# EAGLE design audio_jack_passthru (EAGLE 9.6.2)
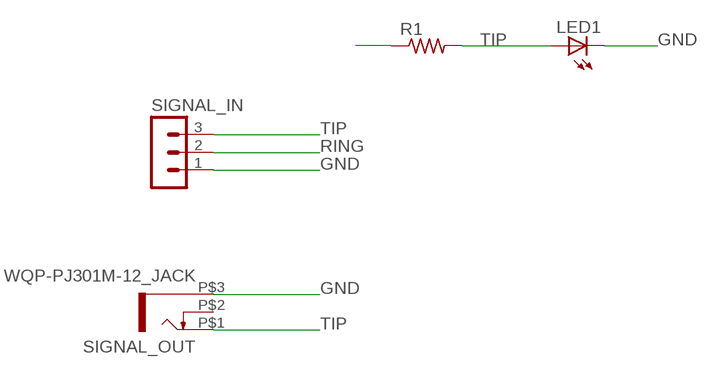
[diagram p0: schematic, sheet 1]

## Parts
LED1  LED3MM  [LED3MM]
R1  R-US_R0805  [R0805]
SIGNAL_IN  MA03-1  [MA03-1]
SIGNAL_OUT  WQP-PJ301M-12_JACK  [WQP-PJ301M-12_JACK]

## Nets
GND: LED1.K(C) SIGNAL_IN.1 SIGNAL_OUT.P$3
RING: SIGNAL_IN.2
TIP: LED1.A R1.1 R1.2 SIGNAL_IN.3 SIGNAL_OUT.P$1
Unconnected: SIGNAL_OUT.P$2

## Library data of the parts
LED1 = adafruit:LED: LED OSRAM: - CHIPLED LG R971, LG N971, LY N971, LG Q971, LY Q971, LO R971, LY R971 LH N974, LH R974 LS Q976, LO Q976, LY Q976 LO Q996 - Hyper CHIPLED LW Q18S LB Q993, LB Q99A, LB R99A - SideLED LS A670, LO A670, LY A670, LG A670, LP A670 LB A673, LV A673, LT A673, LW A673 LH A674 LY A675 LS A676, LA A676, LO A676, LY A676, LW A676 LS A679, LY A679, LG A679 - Hyper Micro SIDELED® LS Y876, LA Y876, LO Y876, LY Y876 LT Y87S - SmartLED LW L88C, LW L88S LB L89C, LB L89S, LG L890 LS L89K, LO L89K, LY L89K LS L896, LA L896, LO L896, LY L896 - TOPLED LS T670, LO T670, LY T670, LG T670, LP T670 LSG T670, LSP T670, LSY T670, LOP T670, LYG T670 LG T671, LOG T671, LSG T671 LB T673, LV T673, LT T673, LW T673 LH T674 LS T676, LA T676, LO T676, LY T676, LB T676, LH T676, LSB T676, LW T676 LB T67C, LV T67C, LT T67C, LS T67K, LO T67K, LY T67K, LW E67C LS E67B, LA E67B, LO E67B, LY E67B, LB E67C, LV E67C, LT E67C LW T67C LS T679, LY T679, LG T679 LS T770, LO T770, LY T770, LG T770, LP T770 LB T773, LV T773, LT T773, LW T773 LH T774 LS E675, LA E675, LY E675, LS T675 LS T776, LA T776, LO T776, LY T776, LB T776 LHGB T686 LT T68C, LB T68C - Hyper Mini TOPLED® LB M676 - Mini TOPLED Santana® LG M470 LS M47K, LO M47K, LY M47K Source: http://www.osram.convergy.de/
R1 = adafruit:R-US_: RESISTOR, American symbol
SIGNAL_IN = con-lstb:MA03-1: PIN HEADER; OC_FARNELL: unknown; OC_NEWARK: unknown
SIGNAL_OUT = thonkiconn:WQP-PJ301M-12_JACK

## Board
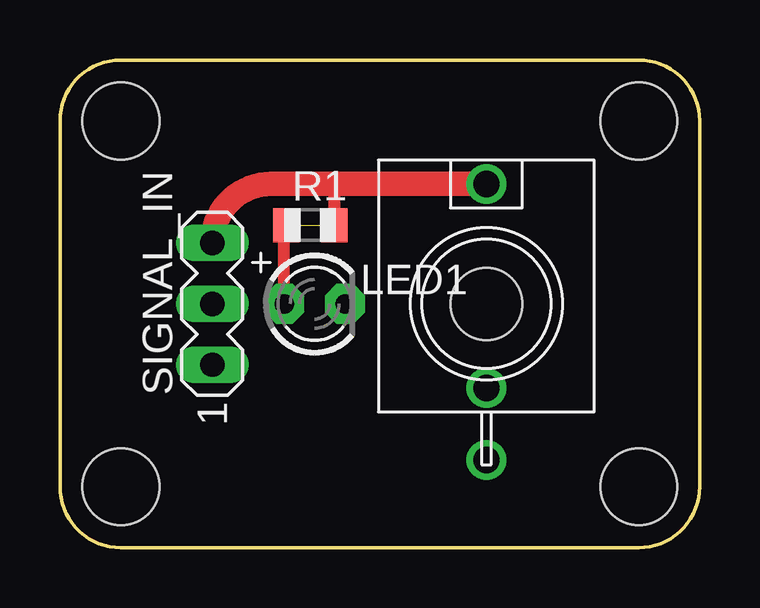
[diagram p1: board, top side]
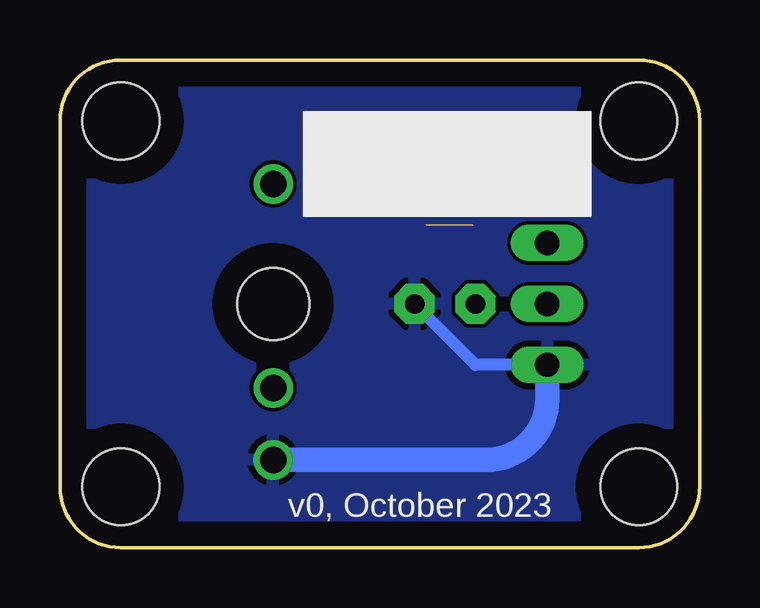
[diagram p2: board, bottom side, seen from below]

Size 26.67 x 20.32 mm. Coordinates in mm from the lower left corner, seen from the top.
Outline: 2.54,20.32 24.13,20.32 arc-90 26.67,17.78 26.67,2.54 arc-90 24.13,0 2.54,0 arc-90 0,2.54 0,17.78 arc-90 2.54,20.32
Copper layers (1*16): Top 0.035mm / dielectric 1.5mm / Bottom 0.035mm
Design rules "default": minimum track width 6mil, minimum drill 0.35mm, track to track 6mil, track to pad 6mil, pad to pad 6mil, via to via 6mil, smd to smd 6mil, copper to edge 40mil, drill to drill 6mil, minimum pad ring 10mil, minimum via ring 8mil, stop-mask expansion 4mil, vias tented up to drill 0mil, thermal gap 10mil
Holes 3 mm at 17.78,10.16
Holes 3.2 mm at 2.54,17.78 24.13,17.78 24.13,2.54 2.54,2.54

### Footprints (pad centres in the part's own frame; a part is rotated, then mirrored left to right if it is on the bottom)
LED3MM = drill 0.813 pad 1.676 octagon: A -1.27,0; K 1.27,0
R0805 = smd 1.1 x 1.4: 1 -1,0; 2 1,0
MA03-1 = drill 1.016 long: 1 -2.54,0; 2 0,0; 3 2.54,0
WQP-PJ301M-12_JACK = drill 1.1: P$1 0,5; P$2 0,-3.5; P$3 0,-6.5

### Placement (x,y rotation side)
LED1  10.62,10.16 0 top
PLABEL0  [PLABEL0]  4.8,17.27 0 top
PLABEL1  [PLABEL1]  2.67,12.09 0 top
PLABEL2  [PLABEL2]  22.99,9.7 0 top
PLABEL3  [PLABEL3]  16.54,18.36 0 bottom
R1  10.44,13.44 0 top
SIGNAL_IN  6.35,10.16 90 top
SIGNAL_OUT  17.78,10.16 0 top

### Tracks (layer width: path | path; a pad name or v marks a point on that pad's centre or on a via)
GND
  Bottom 0.508: SIGNAL_IN.1 9.35,7.62 LED1.K
  Bottom 1.016: SIGNAL_IN.1 6.35,6.2 arc90 8.89,3.66 SIGNAL_OUT.P$3
  pour Bottom: 11.43,20.32 20.32,20.32 24.13,20.32 arc-90 26.67,17.78 26.67,8.89 26.67,2.54 arc-90 24.13,0 19.05,0 2.54,0 arc-90 0,2.54 0,10.16 0,17.78 arc-90 2.54,20.32 3.81,20.32
TIP  (1 unrouted)
  Top 0.508: LED1.A 9.35,13.34 R1.1 | R1.2 11.44,15.12 11.48,15.16
  Top 1.016: SIGNAL_IN.3 arc-90 8.81,15.16 11.48,15.16 SIGNAL_OUT.P$1

### Text on the board
bPlace: v0, October 2023
Pinguin_tBackup: ARTURIA PATCH BAY | ⚡ | ⚡
Pinguin_bBackup: SIGNAL NAME: